# EAGLE design SensorStick (EAGLE 9.6.2)
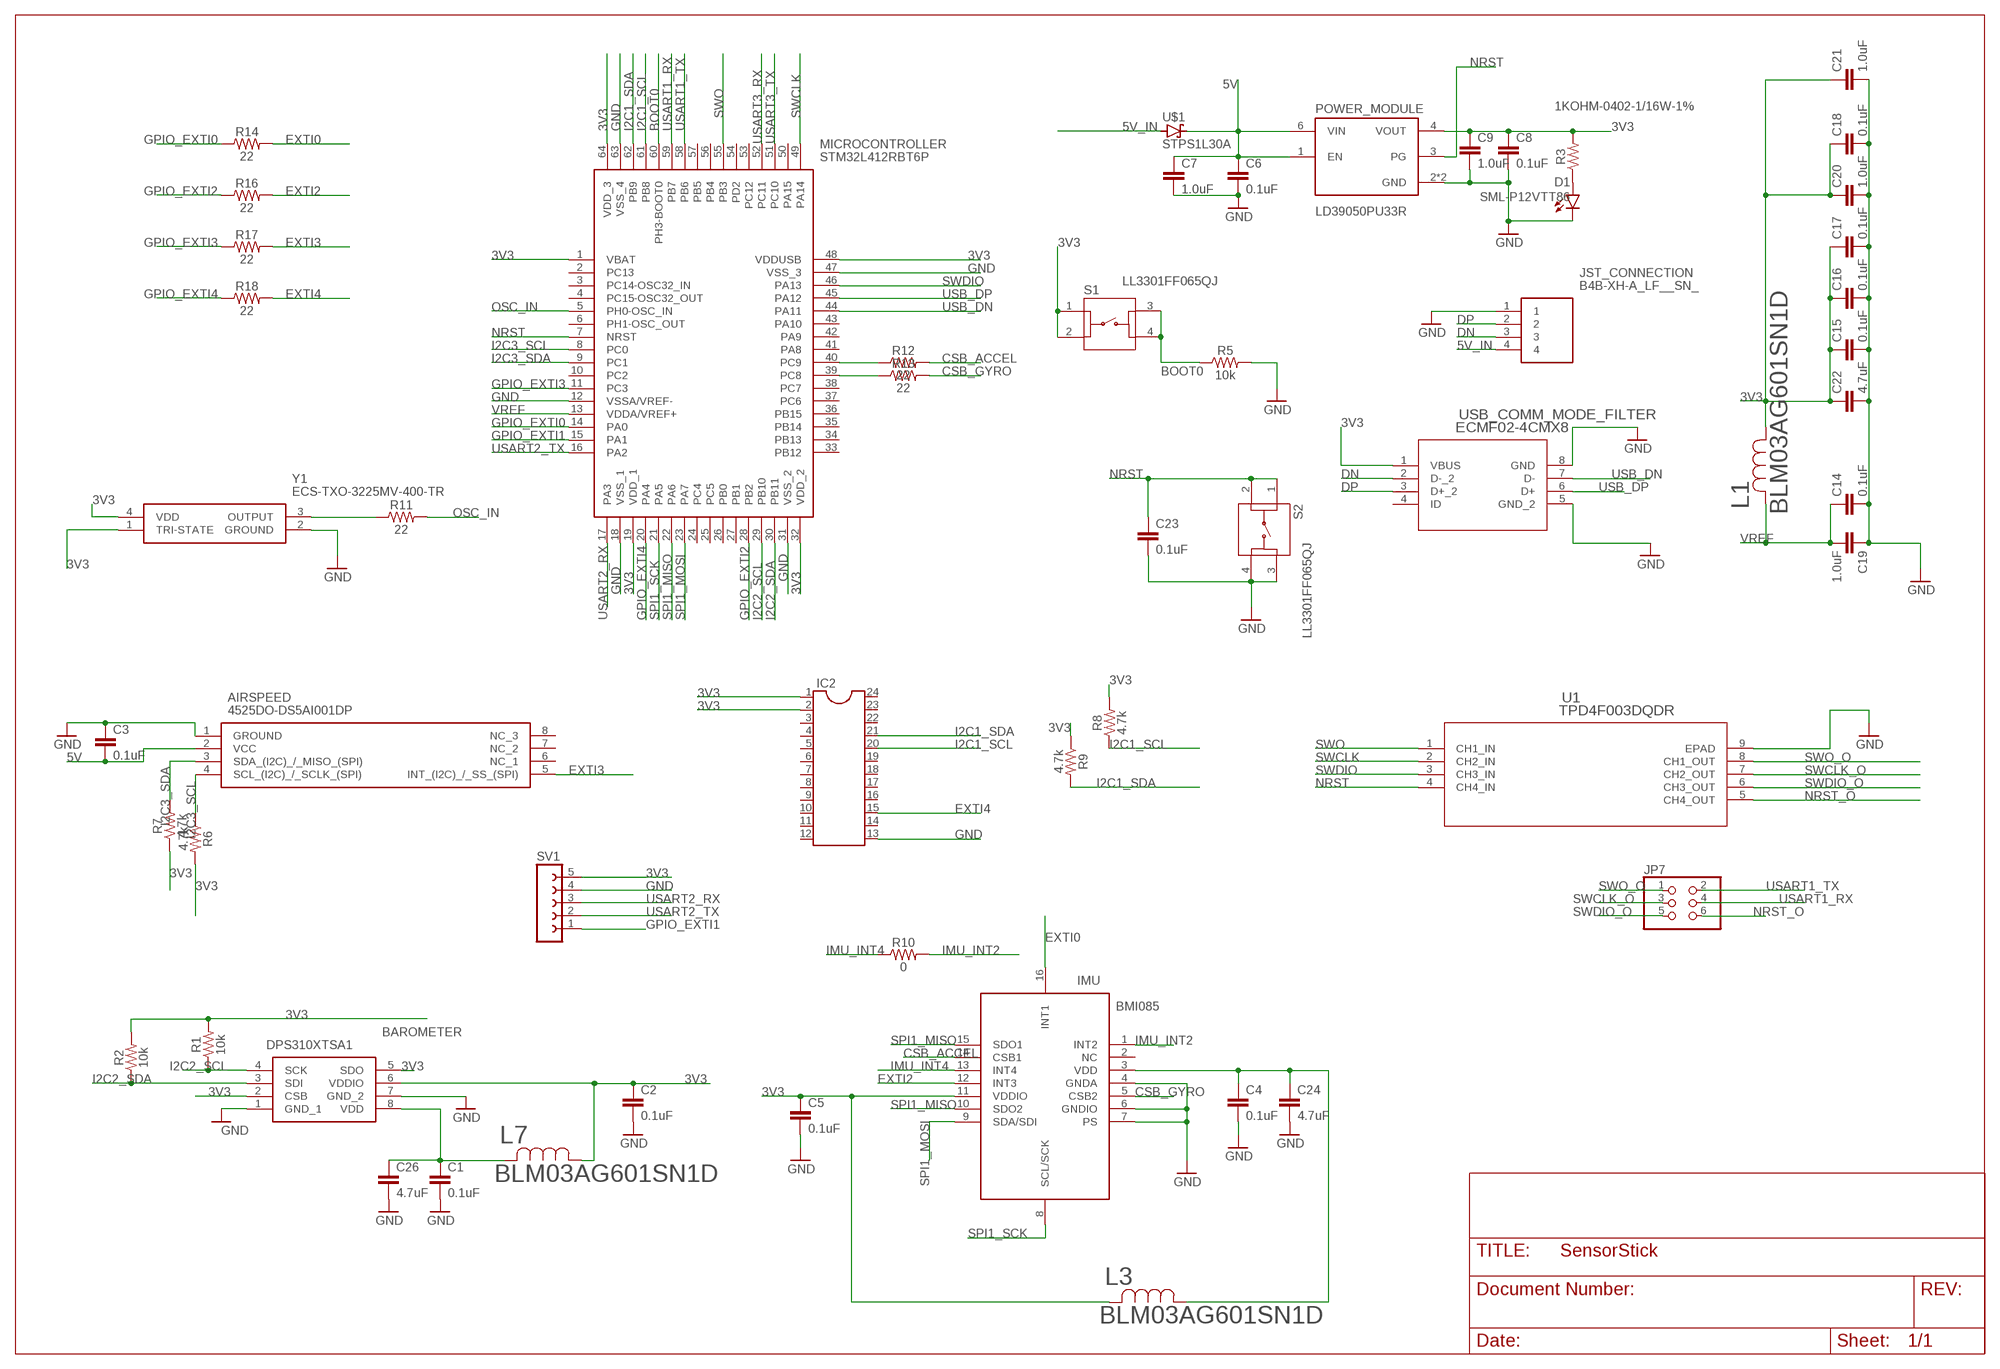
[diagram p0: schematic, sheet 1]

## Parts
AIRSPEED  4525DO-DS5AI001DP  [4525DO-DS...P]
BAROMETER  DPS310XTSA1  [DPS310XTSA1]
C1  0.1uF  0.1UF-0402-6.3V-10%-X7R  [0402]
C2  0.1uF  0.1UF-0402-6.3V-10%-X7R  [0402]
C3  0.1uF  0.1UF-0402-6.3V-10%-X7R  [0402]
C4  0.1uF  0.1UF-0402-6.3V-10%-X7R  [0402]
C5  0.1uF  0.1UF-0402-6.3V-10%-X7R  [0402]
C6  0.1uF  0.1UF-0402-6.3V-10%-X7R  [0402]
C7  1.0uF  1.0UF-0402-16V-10%  [0402]
C8  0.1uF  0.1UF-0402-6.3V-10%-X7R  [0402]
C9  1.0uF  1.0UF-0402-16V-10%  [0402]
C14  0.1uF  0.1UF-0603-25V-5%  [0603]
C15  0.1uF  0.1UF-0603-25V-5%  [0603]
C16  0.1uF  0.1UF-0603-25V-5%  [0603]
C17  0.1uF  0.1UF-0603-25V-5%  [0603]
C18  0.1uF  0.1UF-0603-25V-5%  [0603]
C19  1.0uF  1.0UF-0805-25V-10%  [0805]
C20  1.0uF  1.0UF-0805-25V-10%  [0805]
C21  1.0uF  1.0UF-0805-25V-10%  [0805]
C22  4.7uF  4.7UF0603  [0603]
C23  0.1uF  0.1UF-0603-25V-5%  [0603]
C24  4.7uF  4.7UF0603  [0603]
C26  4.7uF  4.7UF0603  [0603]
D1  SML-P12VTT86  [LED_SML-P11UTT86R]
IC2  DIL24-6  [DIL24-6]
IMU  BMI085  [BMI085]
JP7  PINHD-2X3  [2X03]
JST_CONNECTION  B4B-XH-A_LF__SN_  [B4BXHALFSN]
L1  BLM03AG601SN1D  [IND_BLM03_0201_MUR]
L3  BLM03AG601SN1D  [IND_BLM03_0201_MUR]
L7  BLM03AG601SN1D  [IND_BLM03_0201_MUR]
MICROCONTROLLER  STM32L412RBT6P  [QFP50P1200X1200X160-64N]
POWER_MODULE  LD39050PU33R  [SON95P300X300X100-7N]
R1  10k  10KOHM-0402-1/16W-1%  [0402]
R2  10k  10KOHM-0402-1/16W-1%  [0402]
R3  1KOHM-0402-1/16W-1%  [0402]
R5  10k  10KOHM-0603-1/10W-1%  [0603]
R6  4.7k  4.7KOHM-0603-1/10W-1%  [0603]
R7  4.7k  4.7KOHM-0603-1/10W-1%  [0603]
R8  4.7k  4.7KOHM-0603-1/10W-1%  [0603]
R9  4.7k  4.7KOHM-0603-1/10W-1%  [0603]
R10  0  0OHM-0603-1/10W-5%  [0603]
R11  22  22OHM-0402-1/10W-1%  [0402]
R12  22  22OHM-0402-1/10W-1%  [0402]
R13  22  22OHM-0402-1/10W-1%  [0402]
R14  22  22OHM-0402-1/10W-1%  [0402]
R16  22  22OHM-0402-1/10W-1%  [0402]
R17  22  22OHM-0402-1/10W-1%  [0402]
R18  22  22OHM-0402-1/10W-1%  [0402]
S1  LL3301FF065QJ  [LL3301FF065QJ]
S2  LL3301FF065QJ  [LL3301FF065QJ]
SV1  FE05-1  [FE05-1]
U1  TPD4F003DQDR  [DQD8_1P2X0P4]
U$1  STPS1L30A  [DIOM5226X223N]
USB_COMM_MODE_FILTER  ECMF02-4CMX8  [MICRO_QFN-8L_STM]
Y1  ECS-TXO-3225MV-400-TR  [ECSTXO3225MV400TR]

## Nets
3V3: BAROMETER.2(CSB) BAROMETER.5(SDO) BAROMETER.6(VDDIO) C2.1 C5.1 C8.1 C9.1 C15.1 C16.1 C17.1 C18.1 C20.1 C21.1 C22.1 IC2.1 IC2.2 IMU.11(VDDIO) L1.1 L3.2 L7.1 MICROCONTROLLER.1(VBAT) MICROCONTROLLER.19(VDD_1) MICROCONTROLLER.32(VDD_2) MICROCONTROLLER.48(VDDUSB) MICROCONTROLLER.64(VDD_3) POWER_MODULE.4(VOUT) R1.2 R2.2 R3.2 R6.2 R7.1 R8.2 R9.1 S1.1 S1.2 SV1.5 USB_COMM_MODE_FILTER.1(VBUS) Y1.1(TRI-STATE) Y1.4(VDD)
5V: AIRSPEED.2(VCC) C3.2 C6.1 C7.1 POWER_MODULE.1(EN) POWER_MODULE.6(VIN) U$1.1(C)
5V_IN: JST_CONNECTION.4 U$1.2(A)
BOOT0: MICROCONTROLLER.60(PH3-BOOT0) R5.1 S1.3 S1.4
CSB_ACCEL: IMU.14(CSB1) R12.2
CSB_GYRO: IMU.5(CSB2) R13.2
DN: JST_CONNECTION.3 USB_COMM_MODE_FILTER.2(D-_2)
DP: JST_CONNECTION.2 USB_COMM_MODE_FILTER.3(D+_2)
EXTI0: IMU.16(INT1) R14.2
EXTI2: IMU.12(INT3) R16.2
EXTI3: AIRSPEED.5(INT_(I2C)_/_SS_(SPI)) R17.2
EXTI4: IC2.15 R18.2
GND: AIRSPEED.1(GROUND) BAROMETER.1(GND_1) BAROMETER.7(GND_2) C1.2 C2.2 C3.1 C4.2 C5.2 C6.2 C7.2 C8.2 C9.2 C14.2 C15.2 C16.2 C17.2 C18.2 C19.1 C20.2 C21.2 C22.2 C23.2 C24.2 C26.2 D1.C IC2.13 IMU.4(GNDA) IMU.6(GNDIO) IMU.7(PS) JST_CONNECTION.1 MICROCONTROLLER.12(VSSA/VREF-) MICROCONTROLLER.18(VSS_1) MICROCONTROLLER.31(VSS_2) MICROCONTROLLER.47(VSS_3) MICROCONTROLLER.63(VSS_4) POWER_MODULE.2(GND) POWER_MODULE.7(GND) R5.2 S2.3 S2.4 SV1.4 U1.9(EPAD) USB_COMM_MODE_FILTER.5(GND_2) USB_COMM_MODE_FILTER.8(GND) Y1.2(GROUND)
GPIO_EXTI0: MICROCONTROLLER.14(PA0) R14.1
GPIO_EXTI1: MICROCONTROLLER.15(PA1) SV1.1
GPIO_EXTI2: MICROCONTROLLER.28(PB2) R16.1
GPIO_EXTI3: MICROCONTROLLER.11(PC3) R17.1
GPIO_EXTI4: MICROCONTROLLER.20(PA4) R18.1
I2C1_SCL: IC2.20 MICROCONTROLLER.61(PB8) R8.1
I2C1_SDA: IC2.21 MICROCONTROLLER.62(PB9) R9.2
I2C2_SCL: BAROMETER.4(SCK) MICROCONTROLLER.29(PB10) R1.1
I2C2_SDA: BAROMETER.3(SDI) MICROCONTROLLER.30(PB11) R2.1
I2C3_SCL: AIRSPEED.4(SCL_(I2C)_/_SCLK_(SPI)) MICROCONTROLLER.8(PC0) R6.1
I2C3_SDA: AIRSPEED.3(SDA_(I2C)_/_MISO_(SPI)) MICROCONTROLLER.9(PC1) R7.2
IMU_INT2: IMU.1(INT2) R10.2
IMU_INT4: IMU.13(INT4) R10.1
N$1: R11.1 Y1.3(OUTPUT)
N$3: MICROCONTROLLER.40(PC9) R12.1
N$4: MICROCONTROLLER.39(PC8) R13.1
N$5: D1.A R3.1
N$6: BAROMETER.8(VDD) C1.1 C26.1 L7.2
N$8: C4.1 C24.1 IMU.3(VDD) L3.1
NRST: C23.1 MICROCONTROLLER.7(NRST) POWER_MODULE.3(PG) S2.1 S2.2 U1.4(CH4_IN)
NRST_O: JP7.6 U1.5(CH4_OUT)
OSC_IN: MICROCONTROLLER.5(PH0-OSC_IN) R11.2
SPI1_MISO: IMU.10(SDO2) IMU.15(SDO1) MICROCONTROLLER.22(PA6)
SPI1_MOSI: IMU.9(SDA/SDI) MICROCONTROLLER.23(PA7)
SPI1_SCK: IMU.8(SCL/SCK) MICROCONTROLLER.21(PA5)
SWCLK: MICROCONTROLLER.49(PA14) U1.2(CH2_IN)
SWCLK_O: JP7.3 U1.7(CH2_OUT)
SWDIO: MICROCONTROLLER.46(PA13) U1.3(CH3_IN)
SWDIO_O: JP7.5 U1.6(CH3_OUT)
SWO: MICROCONTROLLER.55(PB3) U1.1(CH1_IN)
SWO_O: JP7.1 U1.8(CH1_OUT)
USART1_RX: JP7.4 MICROCONTROLLER.59(PB7)
USART1_TX: JP7.2 MICROCONTROLLER.58(PB6)
USART2_RX: MICROCONTROLLER.17(PA3) SV1.3
USART2_TX: MICROCONTROLLER.16(PA2) SV1.2
USART3_RX: MICROCONTROLLER.52(PC11)
USART3_TX: MICROCONTROLLER.51(PC10)
USB_DN: MICROCONTROLLER.44(PA11) USB_COMM_MODE_FILTER.7(D-)
USB_DP: MICROCONTROLLER.45(PA12) USB_COMM_MODE_FILTER.6(D+)
VREF: C14.1 C19.2 L1.2 MICROCONTROLLER.13(VDDA/VREF+)
Unconnected: AIRSPEED.6(NC_1) AIRSPEED.7(NC_2) AIRSPEED.8(NC_3) IC2.3 IC2.4 IC2.5 IC2.6 IC2.7 IC2.8 IC2.9 IC2.10 IC2.11 IC2.12 IC2.14 IC2.16 IC2.17 IC2.18 IC2.19 IC2.22 IC2.23 IC2.24 IMU.2(NC) MICROCONTROLLER.2(PC13) MICROCONTROLLER.3(PC14-OSC32_IN) MICROCONTROLLER.4(PC15-OSC32_OUT) MICROCONTROLLER.6(PH1-OSC_OUT) MICROCONTROLLER.10(PC2) MICROCONTROLLER.24(PC4) MICROCONTROLLER.25(PC5) MICROCONTROLLER.26(PB0) MICROCONTROLLER.27(PB1) MICROCONTROLLER.33(PB12) MICROCONTROLLER.34(PB13) MICROCONTROLLER.35(PB14) MICROCONTROLLER.36(PB15) MICROCONTROLLER.37(PC6) MICROCONTROLLER.38(PC7) MICROCONTROLLER.41(PA8) MICROCONTROLLER.42(PA9) MICROCONTROLLER.43(PA10) MICROCONTROLLER.50(PA15) MICROCONTROLLER.53(PC12) MICROCONTROLLER.54(PD2) MICROCONTROLLER.56(PB4) MICROCONTROLLER.57(PB5) USB_COMM_MODE_FILTER.4(ID)

## Library data of the parts
AIRSPEED = 4525DO-DS5AI001DP:4525DO-DS5AI001DP: Differential Pressure Sensor 1PSI Dual Barbs Source: Datasheet <http://www.te.com/commerce/DocumentDelivery/DDEController?Action=srchrtrv&DocNm=MS4525DO&DocType=DS&DocLang=English>; ARROW_PART_NUMBER: 4525DO-DS5AI001DP; ARROW_PRICE-STOCK: https://www.arrow.com/en/products/4525do-ds5ai001dp/te-connectivity; DESCRIPTION: Differential Pressure Sensor 1PSI Dual Barbs; HEIGHT: mm; MANUFACTURER_NAME: TE Connectivity; MANUFACTURER_PART_NUMBER: 4525DO-DS5AI001DP; MOUSER_PART_NUMBER: 824-4525DODS5AI001DP; MOUSER_PRICE-STOCK: https://www.mouser.co.uk/ProductDetail/Measurement-Specialties/4525DO-DS5AI001DP?qs=oFx6pF86PmDUpUCTX7loEA%3D%3D
BAROMETER = DPS310XTSA1:DPS310XTSA1: INFINEON - DPS310XTSA1 - DIGITAL PRESSURE SENSOR, 1200HPA, VLGA-8 Source: Datasheet <https://www.infineon.com/dgdl/Infineon-DPS310-DS-v01_00-EN.pdf?fileId=5546d462576f34750157750826c42242>; ARROW_PART_NUMBER: DPS310XTSA1; ARROW_PRICE-STOCK: https://www.arrow.com/en/products/dps310xtsa1/infineon-technologies-ag?region=nac; DESCRIPTION: INFINEON - DPS310XTSA1 - DIGITAL PRESSURE SENSOR, 1200HPA, VLGA-8; HEIGHT: 1.01mm; MANUFACTURER_NAME: Infineon; MANUFACTURER_PART_NUMBER: DPS310XTSA1; MOUSER_PART_NUMBER: 726-DPS310XTSA1; MOUSER_PRICE-STOCK: https://www.mouser.co.uk/ProductDetail/Infineon-Technologies/DPS310XTSA1?qs=uuTTuBTXn66Ynca8WHwycg%3D%3D
C1 C2 C4-C6 C8 = SparkFun-Capacitors:0.1UF: 0.1µF ceramic capacitors A capacitor is a passive two-terminal electrical component used to store electrical energy temporarily in an electric field.; PROD_ID: CAP-14993
C3 = SparkFun-Capacitors:0.1UF: 0.1µF ceramic capacitors A capacitor is a passive two-terminal electrical component used to store electrical energy temporarily in an electric field.; PROD_ID: CAP-14993; SPICEPREFIX: C
C7 C9 = SparkFun-Capacitors:1.0UF: 1µF ceramic capacitors A capacitor is a passive two-terminal electrical component used to store electrical energy temporarily in an electric field.; PROD_ID: CAP-12417
C14-C18 C23 = SparkFun-Capacitors:0.1UF: 0.1µF ceramic capacitors A capacitor is a passive two-terminal electrical component used to store electrical energy temporarily in an electric field.; PROD_ID: CAP-08604
C19-C21 = SparkFun-Capacitors:1.0UF: 1µF ceramic capacitors A capacitor is a passive two-terminal electrical component used to store electrical energy temporarily in an electric field.; PROD_ID: CAP-08064
C22 C24 C26 = SparkFun-Capacitors:4.7UF: 4.7µF ceramic capacitors A capacitor is a passive two-terminal electrical component used to store electrical energy temporarily in an electric field.; PROD_ID: CAP-08280
D1 = ce-capstone:SML-P12VTT86: SML-P1 Series Red 0402 Clear 60 mcd 2 V Surface Mount PICOLED LED; AVAILABILITY: Unavailable; DESCRIPTION: Red 630nm LED Indication - Discrete 2V 0402 _1006 Metric_; MF: Rohm; MP: SML-P12VTT86; PACKAGE: 0402 Rohm; PRICE: None
IC2 = ic-package:DIL24: Dual In Line
IMU = BMI085:BMI085: IMUs - Inertial Measurement Units High-performance IMU BMI085 for virtual and augmented reality applications Source: Datasheet <https://ae-bst.resource.bosch.com/media/_tech/media/datasheets/BST-BMI085-DS001.pdf>; ARROW_PART_NUMBER: BMI085; ARROW_PRICE-STOCK: https://www.arrow.com/en/products/bmi085/bosch; DESCRIPTION: IMUs - Inertial Measurement Units High-performance IMU BMI085 for virtual and augmented reality applications; HEIGHT: 1mm; MANUFACTURER_NAME: Bosch Sensortec; MANUFACTURER_PART_NUMBER: BMI085; MOUSER_PART_NUMBER: 262-BMI085; MOUSER_PRICE-STOCK: https://www.mouser.co.uk/ProductDetail/Bosch-Sensortec/BMI085?qs=y6ZabgHbY%252ByGCM8LfWZyqA%3D%3D
JP7 = pinhead:PINHD-2X3: PIN HEADER
JST_CONNECTION = B4B-XH-A_LF__SN_:B4B-XH-A_LF__SN_: CONN HEADER VERT 4POS 2.5MM Source: Datasheet <https://datasheet.lcsc.com/szlcsc/JST-Sales-America-B4B-XH-A-LF-SN_C144395.pdf>; ARROW_PART_NUMBER: B4B-XH-A(LF)(SN); ARROW_PRICE-STOCK: https://www.arrow.com/en/products/b4b-xh-a-lf-sn/jst-manufacturing?region=europe; DESCRIPTION: CONN HEADER VERT 4POS 2.5MM; HEIGHT: 7mm; MANUFACTURER_NAME: JST (JAPAN SOLDERLESS TERMINALS); MANUFACTURER_PART_NUMBER: B4B-XH-A(LF)(SN)
L1 L3 L7 = BLM03AG601SN1D:BLM03AG601SN1D; COPYRIGHT: Copyright (C) 2023 Ultra Librarian. All rights reserved.; DIGI-KEY_PART_NUMBER_1: 490-5164-1-ND; DIGI-KEY_PART_NUMBER_2: 490-5164-2-ND; DIGI-KEY_PART_NUMBER_3: 490-5164-6-ND; MANUFACTURER_PART_NUMBER: BLM03AG601SN1D; MFR_NAME: Murata
MICROCONTROLLER = STM32L412RBT6P:STM32L412RBT6P: ARM Microcontrollers - MCU Source: Datasheet <https://www.st.com/resource/en/datasheet/stm32l412c8.pdf>; DESCRIPTION: ARM Microcontrollers - MCU; HEIGHT: 1.6mm; MANUFACTURER_NAME: STMicroelectronics; MANUFACTURER_PART_NUMBER: STM32L412RBT6P; MOUSER_PART_NUMBER: 511-STM32L412RBT6P; MOUSER_PRICE-STOCK: https://www.mouser.co.uk/ProductDetail/STMicroelectronics/STM32L412RBT6P?qs=l7cgNqFNU1hh%252BU1wOZs5Xg%3D%3D
POWER_MODULE = ce-capstone:LD39050PU33R: LD39050 Series 500 mA 3.3 V Fixed Low Noise LDO Voltage Regulator - DFN-6; AVAILABILITY: Unavailable; DESCRIPTION: Linear Voltage Regulator IC 1 Output 500mA 6-DFN _3x3_; MF: STMicroelectronics; MP: LD39050PU33R; PACKAGE: DFN-6 STMicroelectronics; PRICE: None
R1 R2 = SparkFun-Resistors:10KOHM: 10kΩ resistor A resistor is a passive two-terminal electrical component that implements electrical resistance as a circuit element. Resistors act to reduce current flow, and, at the same time, act to lower voltage levels within circuits. - Wikipedia; PROD_ID: RES-14241
R3 = SparkFun-Resistors:1KOHM: 1kΩ resistor A resistor is a passive two-terminal electrical component that implements electrical resistance as a circuit element. Resistors act to reduce current flow, and, at the same time, act to lower voltage levels within circuits. - Wikipedia; PROD_ID: RES-14342
R5 = SparkFun-Resistors:10KOHM: 10kΩ resistor A resistor is a passive two-terminal electrical component that implements electrical resistance as a circuit element. Resistors act to reduce current flow, and, at the same time, act to lower voltage levels within circuits. - Wikipedia; PROD_ID: RES-00824
R6-R9 = SparkFun-Resistors:4.7KOHM: 4.7kΩ resistor A resistor is a passive two-terminal electrical component that implements electrical resistance as a circuit element. Resistors act to reduce current flow, and, at the same time, act to lower voltage levels within circuits. - Wikipedia; PROD_ID: RES-07857
R10 = SparkFun-Resistors:0OHM: 0Ω resistor A resistor is a passive two-terminal electrical component that implements electrical resistance as a circuit element. Resistors act to reduce current flow, and, at the same time, act to lower voltage levels within circuits. - Wikipedia; PROD_ID: RES-08609
R11-R14 R16-R18 = SparkFun-Resistors:22OHM: 22Ω resistor A resistor is a passive two-terminal electrical component that implements electrical resistance as a circuit element. Resistors act to reduce current flow, and, at the same time, act to lower voltage levels within circuits. - Wikipedia; PROD_ID: RES-12427
S1 S2 = ce-capstone:LL3301FF065QJ: Pushbutton Switches 50mA 12VDC F065 7.0mm J-Lead Source: Datasheet <https://componentsearchengine.com/Datasheets/1/LL3301FF065QJ.pdf>; DESCRIPTION: Pushbutton Switches 50mA 12VDC F065 7.0mm J-Lead; HEIGHT: 7.3mm; MANUFACTURER_NAME: E-Switch; MANUFACTURER_PART_NUMBER: LL3301FF065QJ; MOUSER_PART_NUMBER: 612-LL3301FF065QJ; MOUSER_PRICE-STOCK: https://www.mouser.com/Search/Refine.aspx?Keyword=612-LL3301FF065QJ
SV1 = con-lsta:FE05-1: FEMALE HEADER; OC_FARNELL: unknown; OC_NEWARK: unknown
U1 = TPD4F003DQDR:TPD4F003DQDR; COPYRIGHT: Copyright (C) 2023 Ultra Librarian. All rights reserved.; DIGI-KEY_PART_NUMBER_1: 296-25817-1-ND; DIGI-KEY_PART_NUMBER_2: 296-25817-2-ND; DIGI-KEY_PART_NUMBER_3: 296-25817-6-ND; DIGI-KEY_PART_NUMBER_4: 2156-TPD4F003DQDR-ND; MANUFACTURER_PART_NUMBER: TPD4F003DQDR; MFR_NAME: Texas Instruments
U$1 = ce-capstone:STPS1L30A
USB_COMM_MODE_FILTER = ECMF02-4CMX8:ECMF02-4CMX8; COPYRIGHT: Copyright (C) 2023 Ultra Librarian. All rights reserved.; DIGI-KEY_PART_NUMBER_1: 497-13420-2-ND; DIGI-KEY_PART_NUMBER_2: 497-13420-1-ND; DIGI-KEY_PART_NUMBER_3: 497-13420-6-ND; MANUFACTURER_PART_NUMBER: ECMF02-4CMX8; MFR_NAME: STMicroelectronics
Y1 = SamacSys_Parts:ECS-TXO-3225MV-400-TR: TCXO Oscillators 40.000 MHZ Multi-Volt +1.7 3.6V HCMOS TCXO +/-2.5 ppm -30 +85 C 3.2x 2.5mm RoHS Source: Datasheet <https://ecsxtal.com/store/pdf/ECS-TXO-3225MV.pdf>; DESCRIPTION: TCXO Oscillators 40.000 MHZ Multi-Volt +1.7 3.6V HCMOS TCXO +/-2.5 ppm -30 +85 C 3.2x 2.5mm RoHS; HEIGHT: 1.2mm; MANUFACTURER_NAME: ECS; MANUFACTURER_PART_NUMBER: ECS-TXO-3225MV-400-TR

## Board
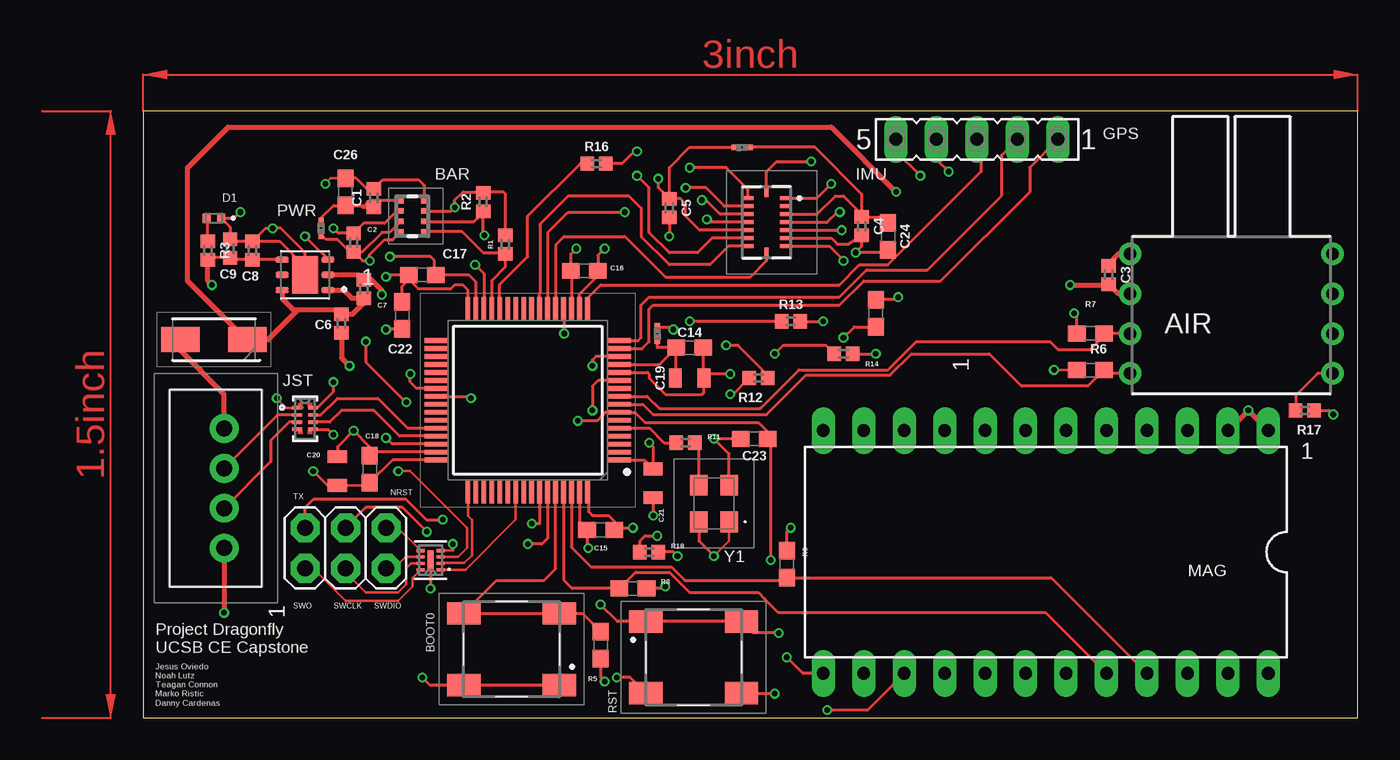
[diagram p1: board, top side]
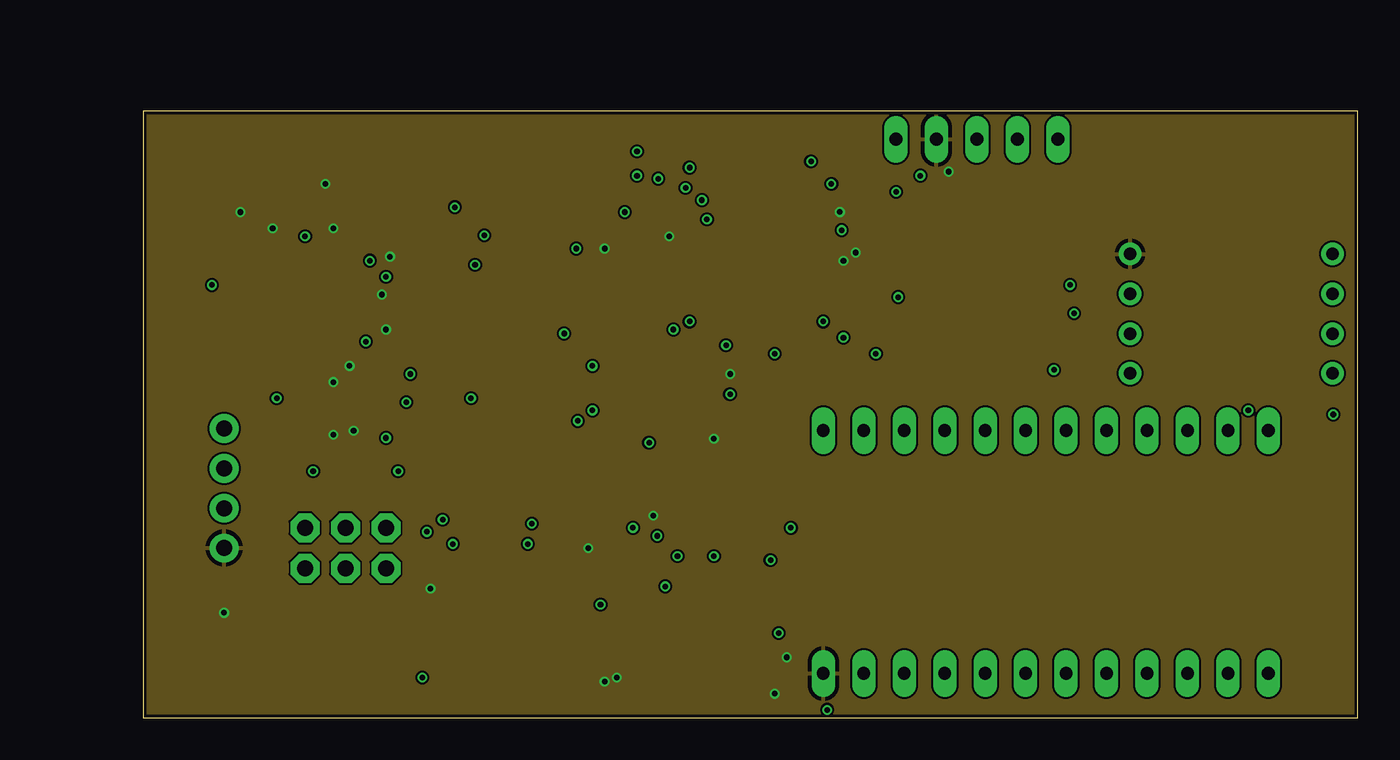
[diagram p2: board, inner layer Route2]
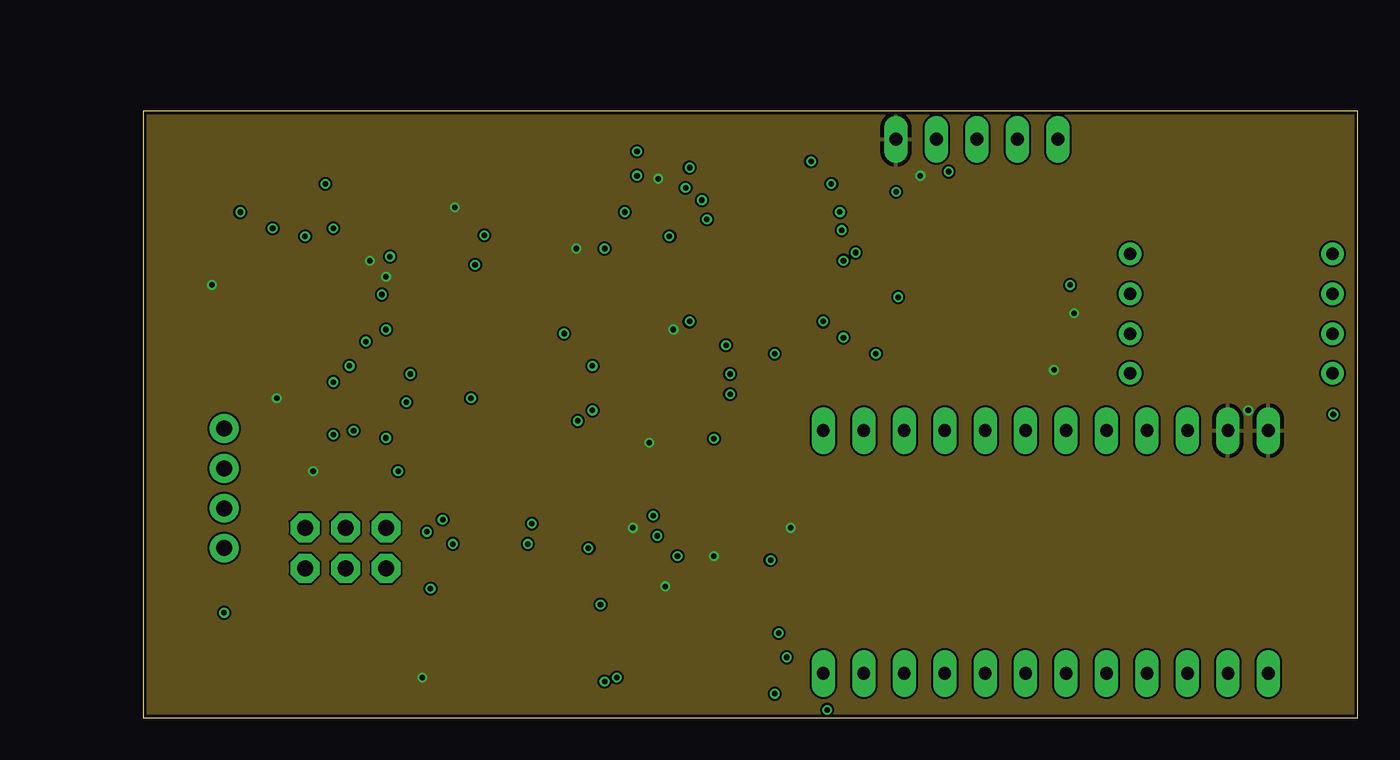
[diagram p3: board, inner layer Route15]
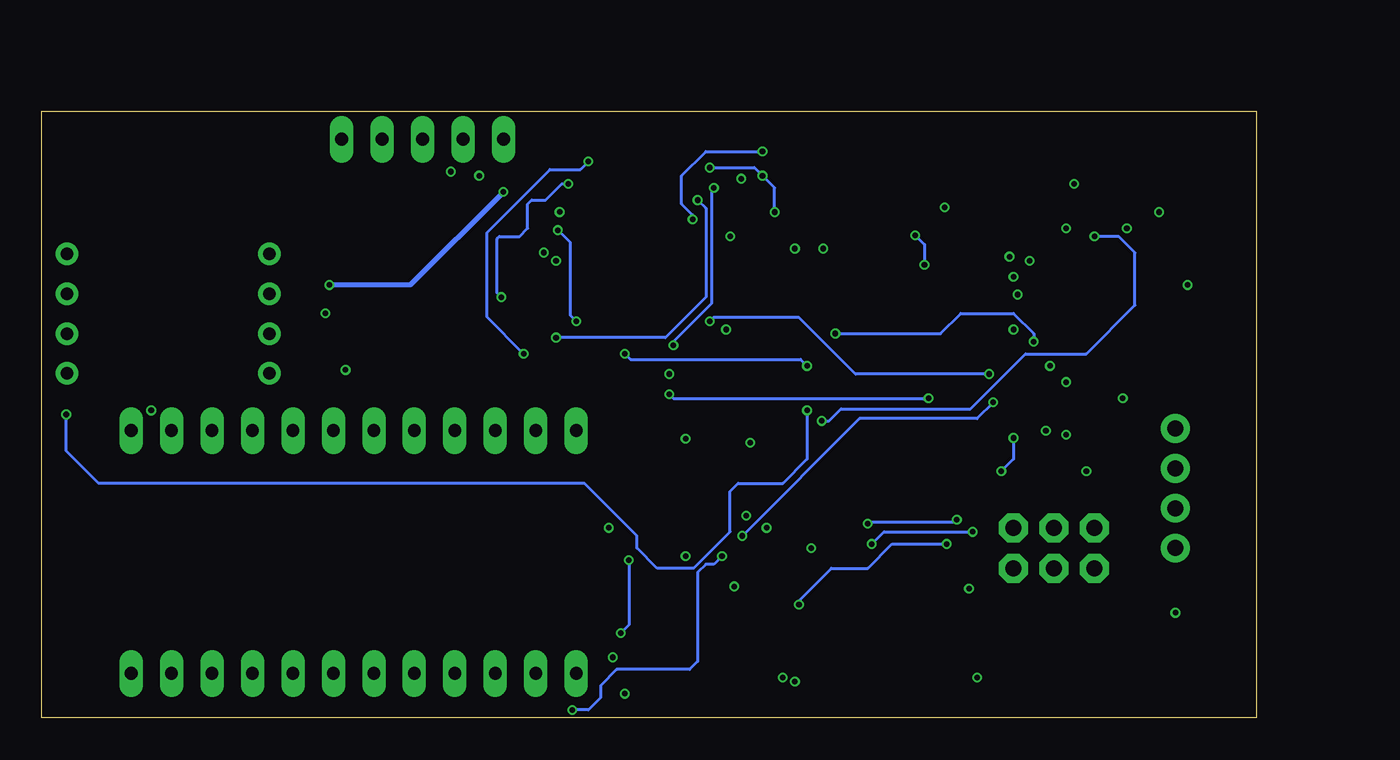
[diagram p4: board, bottom side, seen from below]

Size 76.2 x 38.1 mm. Coordinates in mm from the lower left corner, seen from the top.
Outline: 0,0 76.2,0 76.2,38.1 0,38.1 0,0
Copper layers (1+2*15+16): Top 0.035mm / dielectric 0.2mm / Route2 0.0175mm / dielectric 1.065mm / Route15 0.0175mm / dielectric 0.2mm / Bottom 0.035mm
Design rules "jlcpcb-4layers": minimum track width 3.5mil, minimum drill 0.2mm, track to track 5mil, track to pad 0.2mm, pad to pad 5mil, via to via 0.5mm, smd to smd 5mil, copper to edge 0.2mm, drill to drill 6mil, minimum pad ring 10mil, minimum via ring 0.13mm, stop-mask expansion 0.05mm, vias tented up to drill 16mil, thermal gap 10mil

### Footprints (pad centres in the part's own frame; a part is rotated, then mirrored left to right if it is on the bottom)
4525DO-DS...P = drill 0.78 pad 1.28: 1 1.1,-8.3; 2 3.6,-8.3; 3 6.1,-8.3; 4 8.6,-8.3; 5 8.6,4.4; 6 6.1,4.4; 7 3.6,4.4; 8 1.1,4.4
DPS310XTSA1 = smd 0.35 x 0.35: 1 0.975,-0.725; 2 0.325,-0.725; 3 -0.325,-0.725; 4 -0.975,-0.725; 5 -0.975,0.725; 6 -0.325,0.725; 7 0.325,0.725; 8 0.975,0.725
0402 = smd 0.85 x 0.9: 1 -0.58,0; 2 0.58,0
0603 = smd 1.1 x 1: 1 -0.85,0; 2 0.85,0
0805 = smd 0.8 x 1.2: 1 -0.9,0; 2 0.9,0
LED_SML-P11UTT86R = smd 0.5 x 0.6: A 0.45,0; C -0.45,0
DIL24-6 = drill 0.813 long: 1 -13.97,-7.62; 2 -11.43,-7.62; 3 -8.89,-7.62; 4 -6.35,-7.62; 5 -3.81,-7.62; 6 -1.27,-7.62; 7 1.27,-7.62; 8 3.81,-7.62; 9 6.35,-7.62; 10 8.89,-7.62; 11 11.43,-7.62; 12 13.97,-7.62; 13 13.97,7.62; 14 11.43,7.62; 15 8.89,7.62; 16 6.35,7.62; 17 3.81,7.62; 18 1.27,7.62; 19 -1.27,7.62; 20 -3.81,7.62; 21 -6.35,7.62; 22 -8.89,7.62; 23 -11.43,7.62; 24 -13.97,7.62
BMI085 = smd 0.675 x 0.25: 1 1.165,1.5; 2 1.165,1; 3 1.165,0.5; 4 1.165,0; 5 1.165,-0.5; 6 1.165,-1; 7 1.165,-1.5; 9 -1.165,-1.5; 10 -1.165,-1; 11 -1.165,-0.5; 12 -1.165,0; 13 -1.165,0.5; 14 -1.165,1; 15 -1.165,1.5 | smd 0.25 x 0.675: 8 0,-1.915; 16 0,1.915
2X03 = drill 1.016 octagon: 1 -2.54,-1.27; 2 -2.54,1.27; 3 0,-1.27; 4 0,1.27; 5 2.54,-1.27; 6 2.54,1.27
B4BXHALFSN = drill 1 pad 1.5: 1 0,0; 2 2.5,0; 3 5,0; 4 7.5,0
IND_BLM03_0201_MUR = smd 0.559 x 0.33: 1 -0.394,0; 2 0.394,0
QFP50P1200X1200X160-64N = smd 1.475 x 0.3: 1 -5.738,3.75; 2 -5.738,3.25; 3 -5.738,2.75; 4 -5.738,2.25; 5 -5.738,1.75; 6 -5.738,1.25; 7 -5.738,0.75; 8 -5.738,0.25; 9 -5.738,-0.25; 10 -5.738,-0.75; 11 -5.738,-1.25; 12 -5.738,-1.75; 13 -5.738,-2.25; 14 -5.738,-2.75; 15 -5.738,-3.25; 16 -5.738,-3.75; 33 5.738,-3.75; 34 5.738,-3.25; 35 5.738,-2.75; 36 5.738,-2.25; 37 5.738,-1.75; 38 5.738,-1.25; 39 5.738,-0.75; 40 5.738,-0.25; 41 5.738,0.25; 42 5.738,0.75; 43 5.738,1.25; 44 5.738,1.75; 45 5.738,2.25; 46 5.738,2.75; 47 5.738,3.25; 48 5.738,3.75 | smd 0.3 x 1.475: 17 -3.75,-5.738; 18 -3.25,-5.738; 19 -2.75,-5.738; 20 -2.25,-5.738; 21 -1.75,-5.738; 22 -1.25,-5.738; 23 -0.75,-5.738; 24 -0.25,-5.738; 25 0.25,-5.738; 26 0.75,-5.738; 27 1.25,-5.738; 28 1.75,-5.738; 29 2.25,-5.738; 30 2.75,-5.738; 31 3.25,-5.738; 32 3.75,-5.738; 49 3.75,5.738; 50 3.25,5.738; 51 2.75,5.738; 52 2.25,5.738; 53 1.75,5.738; 54 1.25,5.738; 55 0.75,5.738; 56 0.25,5.738; 57 -0.25,5.738; 58 -0.75,5.738; 59 -1.25,5.738; 60 -1.75,5.738; 61 -2.25,5.738; 62 -2.75,5.738; 63 -3.25,5.738; 64 -3.75,5.738
SON95P300X300X100-7N = smd 0.84 x 0.4: 1 -1.435,0.95; 2 -1.435,0; 3 -1.435,-0.95; 4 1.435,-0.95; 5 1.435,0; 6 1.435,0.95 | smd 1.625 x 2.365: 7 0,0
LL3301FF065QJ = smd 2.1 x 1.4: 1 -3,2.25; 2 3,2.25; 3 -3,-2.25; 4 3,-2.25
FE05-1 = drill 0.813 long: 1 -5.08,0; 2 -2.54,0; 3 0,0; 4 2.54,0; 5 5.08,0
DQD8_1P2X0P4 = smd 0.5 x 0.2: 1 -0.625,0.6; 2 -0.625,0.2; 3 -0.625,-0.2; 4 -0.625,-0.6; 5 0.625,-0.6; 6 0.625,-0.2; 7 0.625,0.2; 8 0.625,0.6 | smd 0.4 x 1.2: 9 0,0
DIOM5226X223N = smd 2.4 x 1.55: 1 -2.1,0; 2 2.1,0
MICRO_QFN-8L_STM = smd 0.61 x 0.203: 1 -0.5,0.675; 2 -0.5,0.225; 3 -0.5,-0.225; 4 -0.5,-0.675; 5 0.5,-0.675; 6 0.5,-0.225; 7 0.5,0.225; 8 0.5,0.675
ECSTXO3225MV400TR = smd 1.3 x 1.1: 1 -1.15,-0.95; 2 1.15,-0.95; 3 1.15,0.95; 4 -1.15,0.95

### Placement (x,y rotation side)
AIRSPEED  70.23,30.23 270 top
BAROMETER  16.89,31.5 90 top
C1  14.48,32.64 90 top
C2  13.21,29.84 90 top
C3  60.58,27.81 270 top
C4  45.09,30.86 270 top
C5  33.02,32 270 top
C6  12.45,24.77 270 top
C7  13.84,26.92 90 top
C8  6.86,29.34 90 top
C9  5.46,29.46 90 top
C14  34.29,23.24 0 top
C15  28.7,11.81 180 top
C16  27.69,28.07 0 top
C17  17.53,27.81 0 top
C18  14.22,15.62 90 top
C19  34.29,21.34 180 top
C20  12.19,15.49 90 top
C21  32,14.73 270 top
C22  16.26,25.27 270 top
C23  38.35,17.53 180 top
C24  46.74,30.23 270 top
C26  12.7,33.02 90 top
D1  4.45,31.37 180 top
IC2  56.64,10.41 180 top
IMU  39.12,31.11 0 top
JP7  12.7,10.67 0 top
JST_CONNECTION  5.08,10.67 90 top
L1  32.26,24.13 270 top
L3  37.59,35.81 180 top
L7  11.18,30.73 90 top
MICROCONTROLLER  24.13,19.94 180 top
POWER_MODULE  10.16,27.81 180 top
R1  22.73,29.72 90 top
R2  21.34,32.38 90 top
R3  4.06,29.34 270 top
R5  28.7,4.57 270 top
R6  59.44,21.84 180 top
R7  59.44,24.13 0 top
R8  30.73,8.13 0 top
R9  40.39,9.65 270 top
R10  45.97,25.4 90 top
R11  34.04,17.27 180 top
R12  38.61,21.34 0 top
R13  40.64,24.89 0 top
R14  43.94,22.86 0 top
R16  28.45,34.8 0 top
R17  72.9,19.3 180 top
R18  31.75,10.41 0 top
S1  23.11,4.32 180 top
S2  34.54,3.81 0 top
SV1  52.32,36.32 180 top
U1  18.03,9.91 180 top
U$1  4.45,23.75 180 top
USB_COMM_MODE_FILTER  10.16,18.8 0 top
Y1  35.81,13.46 90 top

### Tracks (layer width: path | path; a pad name or v marks a point on that pad's centre or on a via)
3V3  (via drill 0.35)
  Top 0.152: v35.81,10.16 36.76,11.11 Y1.1 | C20.1 14.05,14.59 C18.1 | R6.2 v57.15,21.84 | USB_COMM_MODE_FILTER.1 8.98,19.47 v8.38,20.07
  Top 0.203: MICROCONTROLLER.48 15.64,16.19 C18.1 | MICROCONTROLLER.1 31.45,16.19 C21.1 32,17.02 v31.75,17.27 | MICROCONTROLLER.19 26.88,28.02 C16.1 26.84,29.12 v27.18,29.46 | 16.68,27.52 17.27,26.92 19.3,26.92 19.56,27.18 20.06,27.18 20.38,26.86 MICROCONTROLLER.32 | 16.68,27.52 C17.1 15.37,27.81 v15.24,27.69 | C22.1 16.26,27.1 16.68,27.52 | MICROCONTROLLER.64 27.94,14.14 27.94,12.95 28.19,12.7 29.21,12.7 29.55,12.36 C15.1 29.68,11.94 v30.73,11.94 | v35.81,10.16 34.86,11.11 Y1.4 | v32.77,8.26 32.64,8.13 R8.2 | BAROMETER.2 19.32,31.82 v19.56,32.06 19.56,32.51 20.07,33.02 21.28,33.02 R2.2 21.39,33.02 22.61,33.02 22.73,32.89 R1.2 | BAROMETER.5 15.66,30.01 15.15,30.01 14.22,29.09 v14.22,28.7 13.77,28.7 C2.1 | BAROMETER.6 15.47,30.48 14.99,30.48 13.77,29.27 C2.1 | C20.1 11.57,14.59 v10.67,15.49 | IMU.11 34.92,30.61 34.04,31.5 34.04,32.26 33.71,32.58 C5.1 | C5.1 33.02,34.54 34.29,35.81 L3.2 | C2.1 12.95,29.27 12.19,30.03 11.49,30.03 L7.1 | C5.1 32.32,33.28 v32.32,33.85 | S1.1 S1.2 18,2.07 v17.53,2.54 | POWER_MODULE.4 C8.1 5.59,28.76 C9.1 4.19,28.88 R3.2 | L1.1 33.13,24.52 v33.27,24.38 | R7.1 58.59,25.23 v58.42,25.4 | SV1.5 47.24,35.56 v48.77,34.04 | R9.1 40.39,11.68 v40.64,11.94
  Top 0.305: R3.2 4.06,27.43 v4.32,27.18 | IC2.2 v69.34,19.3 IC2.1
  pour Route15: 0,38.1 76.2,38.1 76.2,0 0,0
5V  (via drill 0.35)
  Top 0.305: POWER_MODULE.6 8.72,26.33 9.45,25.6 9.71,25.6 | C3.2 60.63,27.18 | 60.63,27.18 61.19,26.63 AIRSPEED.2 | 9.71,25.6 12.19,25.6 C6.1 13.15,25.34 13.84,26.04 C7.1 13.08,26.34 12.56,26.86 POWER_MODULE.1 | 9.71,25.6 7.86,23.75 U$1.1 6.48,23.75 2.79,27.43 2.79,34.54 5.33,37.08 43.18,37.08 v47.24,33.02 | v58.17,27.18 60.63,27.18
  Bottom 0.305: v47.24,33.02 53.09,27.18 v58.17,27.18
5V_IN
  Top 0.305: JST_CONNECTION.4 5.08,20.32 2.35,23.05 U$1.2
BOOT0
  Top 0.203: MICROCONTROLLER.60 25.88,9.37 25.15,8.64 22.18,8.64 S1.4 S1.3 27.56,6.57 R5.1
CSB_ACCEL  (via drill 0.35)
  Top 0.203: IMU.14 36.47,32.12 35.31,33.27 v34.04,33.27 | v36.58,23.39 37.34,23.39 39.19,21.54 R12.2
  Bottom 0.203: v34.04,33.27 34.19,33.12 34.19,26.01 36.69,23.51 v36.58,23.39
CSB_GYRO  (via drill 0.35)
  Top 0.203: IMU.5 v43.83,30.62 | R13.2 v42.67,24.89
  Bottom 0.203: v43.83,30.62 43.82,30.62 43.06,29.86 43.06,25.28 v42.67,24.89
DN
  Top 0.203: USB_COMM_MODE_FILTER.2 8.43,19.02 JST_CONNECTION.3
DP
  Top 0.203: USB_COMM_MODE_FILTER.3 9.15,18.57 8,17.42 8,16.09 JST_CONNECTION.2
EXTI0  (via drill 0.35)
  Top 0.203: IMU.16 39.12,34.29 39.75,34.93 v41.91,34.93 | R14.2 v45.97,22.86
  Bottom 0.203: v45.97,22.86 48.27,25.15 48.27,30.47 44.32,34.42 42.42,34.42 v41.91,34.93
EXTI2  (via drill 0.35)
  Top 0.203: IMU.12 35.55,31.11 v35.38,31.29 | v30.99,35.56 30.81,35.56 30.04,34.8 R16.2
  Bottom 0.203: v35.38,31.29 35.38,31.57 36.07,32.26 36.07,34.04 34.54,35.56 v30.99,35.56
EXTI3
  Top 0.203: AIRSPEED.5 73.7,21.63 72.32,20.25 R17.2
EXTI4  (via drill 0.35)
  Top 0.203: v33.53,10.16 33.27,10.41 R18.2 | v42.93,0.51 45.47,0.51 IC2.15
  Bottom 0.203: v33.53,10.16 34.04,9.65 34.54,9.65 35.05,9.14 35.05,3.56 35.56,3.05 40.13,3.05 41.15,2.03 41.15,1.27 41.91,0.51 v42.93,0.51
GND  (via drill 0.35)
  Top 0.152: C26.2 11.77,33.87 v11.43,33.53
  Top 0.203: C20.2 12.19,17.02 v13.21,18.03 14.22,17.02 C18.2 14.44,16.69 MICROCONTROLLER.47 | v15.49,28.96 18.03,28.96 18.29,28.7 18.29,27.9 C17.2 20.44,27.81 20.88,27.37 MICROCONTROLLER.31 | C22.2 15.28,24.42 v15.24,24.38 | C21.2 v32,12.7 | v27.94,10.67 27.85,10.76 C15.2 27.38,12.28 MICROCONTROLLER.63 | MICROCONTROLLER.18 27.38,26.62 28.54,27.77 C16.2 28.54,29.04 v28.96,29.46 | C14.2 35.14,21.39 C19.1 | v36.83,21.59 35.44,21.59 C19.1 | MICROCONTROLLER.12 31.65,21.69 31.75,21.59 31.75,21.34 32.77,20.32 35.05,20.32 35.19,20.46 C19.1 | Y1.2 36.76,16.58 v35.81,17.53 C23.2 | R5.2 28.7,2.54 v28.96,2.29 | S2.3 30.56,2.54 v29.72,2.54 | IMU.6 43.18,30.11 43.56,29.73 44.28,29.73 C4.2 45.09,29.59 v44.7,29.21 46.57,29.21 C24.2 | v43.94,28.7 43.94,28.75 43.08,29.61 IMU.7 | BAROMETER.7 15.91,31.82 15.15,31.06 13.84,31.06 C2.2 12.25,30.43 v11.94,30.73 | USB_COMM_MODE_FILTER.5 11.6,18.12 v11.94,17.78 | C26.2 13.37,33.87 14.03,33.22 C1.2 15.04,33.78 17.27,33.78 17.62,33.44 BAROMETER.1 | C5.2 v33.02,30.23 | v39.62,1.52 37.54,1.52 S2.4 | IMU.4 42.92,31.11 43.56,31.75 v43.72,31.75 | USB_COMM_MODE_FILTER.8 10.91,19.47 11.94,20.5 v11.94,21.08 | U1.9 v18.03,8.13 | C8.2 5.59,29.92 C9.2 5.46,30.8 D1.C 5.71,31.37 v6.1,31.75 | C8.2 8.56,29.92 10.16,28.32 POWER_MODULE.7 10.16,29.21 8.64,30.73 v8.13,30.73 7.67,30.73 C8.2 | v50.55,34.29 49.78,35.05 SV1.4 | IC2.13 41.4,2.79 v40.39,3.81
  Top 0.305: AIRSPEED.1 61.17,29.13 60.58,28.54 C3.1 | JST_CONNECTION.1 v5.08,6.6 | POWER_MODULE.2 13.53,27.81 C7.2 14.31,27.5 14.99,26.83 v14.99,26.58 | C6.2 12.45,22.61 v12.95,22.1
  pour Route2: 0,38.1 76.2,38.1 76.2,0 0,0
GPIO_EXTI0  (via drill 0.35)
  Top 0.203: v28.19,22.1 28.19,22.47 28.41,22.69 MICROCONTROLLER.14 | R14.1 42.85,23.37 40.13,23.37 v39.62,22.86
  Bottom 0.203: v39.62,22.86 39.27,22.5 28.6,22.5 v28.19,22.1
GPIO_EXTI1
  Top 0.203: MICROCONTROLLER.15 31.32,23.19 31.75,23.62 31.75,25.65 32,25.91 43.69,25.91 45.21,27.43 50.04,27.43 55.63,33.02 55.63,34.54 SV1.1
GPIO_EXTI2
  Top 0.203: MICROCONTROLLER.28 22.38,27.21 24.13,28.96 24.13,31.5 27.43,34.8 R16.1
GPIO_EXTI3  (via drill 0.35)
  Top 0.203: MICROCONTROLLER.11 28.55,21.19 28.19,20.83 v28.19,19.3 | R17.1 74.42,19.3 v74.68,19.05
  Bottom 0.203: v28.19,19.3 28.19,16.26 29.72,14.73 32.51,14.73 33.02,14.22 33.02,11.68 35.31,9.4 37.59,9.4 38.86,10.67 38.86,11.43 42.16,14.73 72.64,14.73 74.68,16.76 v74.68,19.05
GPIO_EXTI4  (via drill 0.35)
  Top 0.203: MICROCONTROLLER.20 26.42,25.64 v26.42,24.13 | v13.97,23.62 13.97,22.35 v16.51,19.81 | v32.26,11.43 31.5,11.43 31.17,11.1 R18.1
  Bottom 0.203: v26.42,24.13 19.81,24.13 18.54,25.4 15.24,25.4 13.97,24.13 v13.97,23.62 | v16.51,19.81 17.53,18.8 24.89,18.8 v32.26,11.43
I2C1_SCL
  Top 0.203: MICROCONTROLLER.61 26.38,8.67 26.92,8.13 R8.1 30.9,9.14 33.02,9.14 34.29,7.87 38.61,7.87 38.99,7.49 39.88,6.6 56.64,6.6 IC2.20
I2C1_SDA
  Top 0.203: MICROCONTROLLER.62 26.88,10.71 28.12,9.47 33.16,9.47 33.99,8.64 40.22,8.64 R9.2 56.98,8.8 IC2.21
I2C2_SCL
  Top 0.203: BAROMETER.4 20.02,30.52 21.34,29.21 22.66,29.21 R1.1 22.73,28.32 21.88,27.47 MICROCONTROLLER.29
I2C2_SDA  (via drill 0.35)
  Top 0.203: v20.83,28.45 21.38,27.9 MICROCONTROLLER.30 | v21.4,30.29 21.34,30.36 21.34,31.75 | 21.34,31.75 R2.1 | 21.34,31.75 20.76,31.17 BAROMETER.3
  Bottom 0.203: v21.4,30.29 20.83,29.72 v20.83,28.45
I2C3_SCL
  Top 0.203: MICROCONTROLLER.8 31.36,19.69 32,19.05 39.12,19.05 41.58,21.51 46.87,21.51 48.22,22.86 53.09,22.86 55.12,20.83 59.27,20.83 R6.1 60.67,21.63 AIRSPEED.4
I2C3_SDA
  Top 0.203: MICROCONTROLLER.9 31.63,20.19 32.38,19.43 38.73,19.43 41.15,21.84 46.74,21.84 48.51,23.62 56.9,23.62 57.4,23.11 59.44,23.11 60.45,24.13 | AIRSPEED.3 60.45,24.13 | 60.45,24.13 R7.2
IMU_INT2  (via drill 0.35)
  Top 0.203: R10.2 47.24,26.25 47.38,26.39 v47.38,26.42 | v43.18,33.53 42.27,32.62 IMU.1
  Bottom 0.203: v43.18,33.53 43.57,33.53 44.59,32.51 45.47,32.51 45.72,32.26 45.72,30.73 46.23,30.23 47.5,30.23 47.63,30.09 47.63,26.67 v47.38,26.42
IMU_INT4  (via drill 0.35)
  Top 0.203: IMU.13 36.2,31.61 35.31,32.5 v35.06,32.5 | v43.94,23.88 44.62,24.55 R10.1
  Bottom 0.203: v35.06,32.5 34.54,31.99 34.54,26.42 37.08,23.88 v43.94,23.88
N$1
  Top 0.203: Y1.3 34.86,17.02 R11.1
N$3  (via drill 0.35)
  Top 0.203: MICROCONTROLLER.40 20.45,20.19 v20.57,20.07 | R12.1 37.01,20.32 v36.83,20.32
  Bottom 0.203: v36.83,20.32 36.58,20.07 v20.57,20.07
N$4  (via drill 0.35)
  Top 0.203: MICROCONTROLLER.39 17.16,20.69 16.76,21.08 v16.76,21.59 | R13.1 v34.29,24.89
  Bottom 0.203: v16.76,21.59 25.15,21.59 28.7,25.15 34.04,25.15 v34.29,24.89
N$5
  Top 0.203: R3.1 4.06,31.3 D1.A
N$6
  Top 0.203: BAROMETER.8 14.18,32.47 13.77,32.06 C1.1 14.37,32.17 C26.1 11.94,32.17 11.15,31.38 11.15,31.15 L7.2
N$8
  Top 0.203: C4.1 46.28,31.44 46.69,31.03 C24.1 | L3.1 42.16,35.81 45.09,32.89 C4.1 | IMU.3 42.28,31.61 43.43,32.77 43.94,32.77 45.09,31.62 C4.1
NRST  (via drill 0.35)
  Top 0.152: U1.4 19.43,10.51 v19.43,10.92
  Top 0.203: v27.28,18.65 v27.29,18.64 28.47,18.64 29.01,19.19 MICROCONTROLLER.7 30.85,19.19 31.49,18.55 32.69,18.55 32.69,18.54 38.61,18.54 39.2,17.95 C23.1 39.37,17.36 v39.37,9.91 | v10.16,30.23 11.09,29.3 11.1,29.3 11.6,28.8 POWER_MODULE.3 | v39.88,5.33 38.27,5.33 S2.2 S2.1 29.75,6.06 v28.7,7.11
  Bottom 0.203: v19.43,10.92 22.86,10.92 24.38,9.4 26.67,9.4 28.7,7.37 v28.7,7.11 | v27.28,18.65 26.82,18.65 26.06,19.41 17.93,19.41 14.48,22.86 10.67,22.86 7.62,25.91 7.62,29.21 8.64,30.23 v10.16,30.23 | v39.37,9.91 39.37,5.84 v39.88,5.33
NRST_O
  Top 0.152: JP7.6 15.33,12.03 15.88,12.03 U1.5
OSC_IN
  Top 0.203: MICROCONTROLLER.5 31.78,18.19 32.69,17.27 R11.2
SPI1_MISO  (via drill 0.35)
  Top 0.203: MICROCONTROLLER.22 25.38,30.46 26.67,31.75 v30.23,31.75 | IMU.15 37.95,33.17 36.58,34.54 v34.29,34.54 | IMU.10 35.7,30.11 34.8,29.21 33.02,29.21 31.75,30.48 31.75,33.27 v30.99,34.04
  Bottom 0.203: v30.23,31.75 30.23,33.27 v30.99,34.04 31.5,34.54 v34.29,34.54
SPI1_MOSI
  Top 0.203: IMU.9 36.73,29.61 35.56,28.45 33.02,28.45 31.24,30.23 31.24,32 30.48,32.77 26.67,32.77 24.89,30.99 24.89,26.68 24.88,26.67 MICROCONTROLLER.23
SPI1_SCK
  Top 0.203: MICROCONTROLLER.21 25.88,29.69 26.42,30.23 30.23,30.23 32.77,27.69 38.1,27.69 39.12,28.7 IMU.8
SWCLK
  Top 0.152: MICROCONTROLLER.49 20.38,12.68 20.63,12.42 20.63,10.22 20.14,9.73 18.68,9.73 U1.2
SWCLK_O
  Top 0.152: U1.7 16.82,9.71 16.51,9.39 16.51,8.38 16,7.87 13.97,7.87 12.7,9.14 JP7.3
SWDIO  (via drill 0.35)
  Top 0.152: v16,15.49 16.76,15.49 20.32,11.94 20.32,10.67 19.76,10.11 U1.3
  Top 0.203: MICROCONTROLLER.46 15.63,17.19 v15.24,17.57
  Bottom 0.203: v15.24,17.57 15.24,16.26 v16,15.49
SWDIO_O
  Top 0.152: U1.6 16.47,10.11 15.76,9.4 JP7.5
SWO
  Top 0.152: U1.1 20.23,9.31 23.38,12.46 MICROCONTROLLER.55
SWO_O
  Top 0.152: U1.8 16.9,8.8 16.9,8.27 16,7.37 12.7,7.37 10.67,9.4 JP7.1
USART1_RX  (via drill 0.35)
  Top 0.203: MICROCONTROLLER.59 25.38,11.28 25.02,10.92 v24.13,10.92 | v17.8,11.68 16.28,13.21 13.97,13.21 JP7.4
  Bottom 0.203: v17.8,11.68 23.37,11.68 v24.13,10.92
USART1_TX  (via drill 0.35)
  Top 0.203: MICROCONTROLLER.58 24.88,12.19 v24.38,12.19 | JP7.2 10.16,13.21 10.67,13.72 16.51,13.72 17.78,12.45 v18.8,12.45
  Bottom 0.203: v24.38,12.19 24.25,12.32 18.92,12.32 v18.8,12.45
USART2_RX
  Top 0.203: MICROCONTROLLER.17 27.88,26.36 28.7,27.18 43.69,27.18 44.96,28.45 46.74,28.45 52.58,34.29 52.58,36.07 SV1.3
USART2_TX
  Top 0.203: MICROCONTROLLER.16 31.05,23.69 31.24,23.88 31.24,25.91 31.75,26.42 43.69,26.42 45.39,28.12 49.2,28.12 53.85,32.77 53.85,35.31 SV1.2
USB_DN
  Top 0.203: MICROCONTROLLER.44 16.61,18.19 14.73,20.07 12.19,20.07 11.15,19.02 USB_COMM_MODE_FILTER.7
USB_DP
  Top 0.203: USB_COMM_MODE_FILTER.6 11.71,18.57 12.45,19.3 14.48,19.3 16.09,17.69 MICROCONTROLLER.45
VREF
  Top 0.203: 33.39,23.19 C14.1 32.26,23.24 L1.2 | 33.39,23.19 C19.2 | MICROCONTROLLER.13 32.39,22.19 33.39,23.19
(copper drawn outside any net)
  shapes: Top area x2

### Text on the board
tPlace: GPS | BAR | IMU | PWR | 1 | AIR | 1 | JST | 1 | TX | NRST | MAG | 1 | SWO | SWCLK | SWDIO | BOOT0 | Project Dragonfly / UCSB CE Capstone | RST | Jesus Oviedo / Noah Lutz / Teagan Connon / Marko Ristic / Danny Cardenas | ⠀⠀⠀⠀⠀⠀⢀⣀⣀⠀⠀⠀⠀⠀⠀⠀⠀⠀⠀⠀⠀⠀⠀⠀⠀⠀⠀⠀⠀⠀ / ⠀⠀⠀⠀⠀⠀⣿⠉⠙⠻⣦⡀⠀⠀⠀⠀⠀⠀⠀⠀⠀⠀⠀⠀⠀⠀⠀⠀⠀⠀ / ⠀⠀⢀⣶⠿⠶⣿⣄⠀⠀⠈⢿⣄⠀⠀⠀⠀⠀⠀⠀⠀⠀⠀⠀⠀⠀⠀⠀⠀⠀ / ⠀⠀⠈⣧⠀⠀⠘⣿⣷⣄⠀⠀⢻⣦⠀⠀⣀⣄⡀⠀⠀⠀⠀⠀⠀⠀⠀⠀⠀⠀ / ⠀⠀⠀⠘⣧⡀⠀⠘⣷⡙⢷⣄⠀⠹⣧⠀⢿⣿⣷⣦⡄⠀⠀⠀⠀⠀⠀⠀⠀⠀ / ⠀⠀⠀⠀⠈⢿⣄⠀⠘⢷⡄⠹⣧⠀⠛⣂⠀⢸⣿⣿⣿⣄⠀⠀⠀⠀⠀⠀⠀⠀ / ⠀⠀⠀⠀⠀⠀⠙⢷⣄⠈⠻⡦⠀⣠⣾⣿⣷⣤⠈⠙⠿⠿⠁⠀⠀⠀⠀⠀⠀⠀ / ⠀⠀⠀⠀⠀⠀⠀⠀⠙⢷⣦⠀⣼⣿⣿⣿⣿⠟⠀⢶⣤⣄⡀⠀⠀⠀⠀⠀⠀⠀ / ⠀⠀⠀⠀⠀⠀⠀⠀⠀⠀⠈⣀⣿⠿⠿⠛⢁⠰⣦⣀⠀⠉⠻⢶⣤⡀⠀⠀⠀⠀ / ⠀⠀⠀⠀⠀⠀⠀⠀⢀⣤⣾⡟⠁⠠⣦⡀⠙⢷⣌⡛⢷⣄⠀⠀⠈⠻⢷⣄⠀⠀ / ⠀⠀⠀⠀⠀⠀⣠⣶⣿⣿⠋⠀⠀⠀⠙⢷⣄⠀⠉⠻⢶⣽⣷⣄⠀⠀⠀⢻⣆⠀ / ⠀⠀⠀⢀⣴⣾⣿⣿⠟⠁⠀⠀⠀⠀⠀⠀⠙⢷⣄⠀⠀⠈⠙⠻⣷⣶⣤⣴⠟⠀ / ⠀⢠⣾⣿⣿⣿⡿⠋⠀⠀⠀⠀⠀⠀⠀⠀⠀⠀⠙⠻⣦⡀⠀⠀⠸⣧⠀⠀⠀⠀ / ⠀⢸⣿⣿⣿⠟⠁⠀⠀⠀⠀⠀⠀⠀⠀⠀⠀⠀⠀⠀⠀⠉⠓⠶⠟⠋⠀⠀⠀⠀ / ⠀⠀⠉⠉⠉⠀⠀⠀⠀⠀⠀⠀⠀⠀⠀⠀⠀⠀⠀⠀⠀⠀⠀⠀⠀⠀⠀⠀⠀⠀